# Altium project diban v0.0.PrjPCB
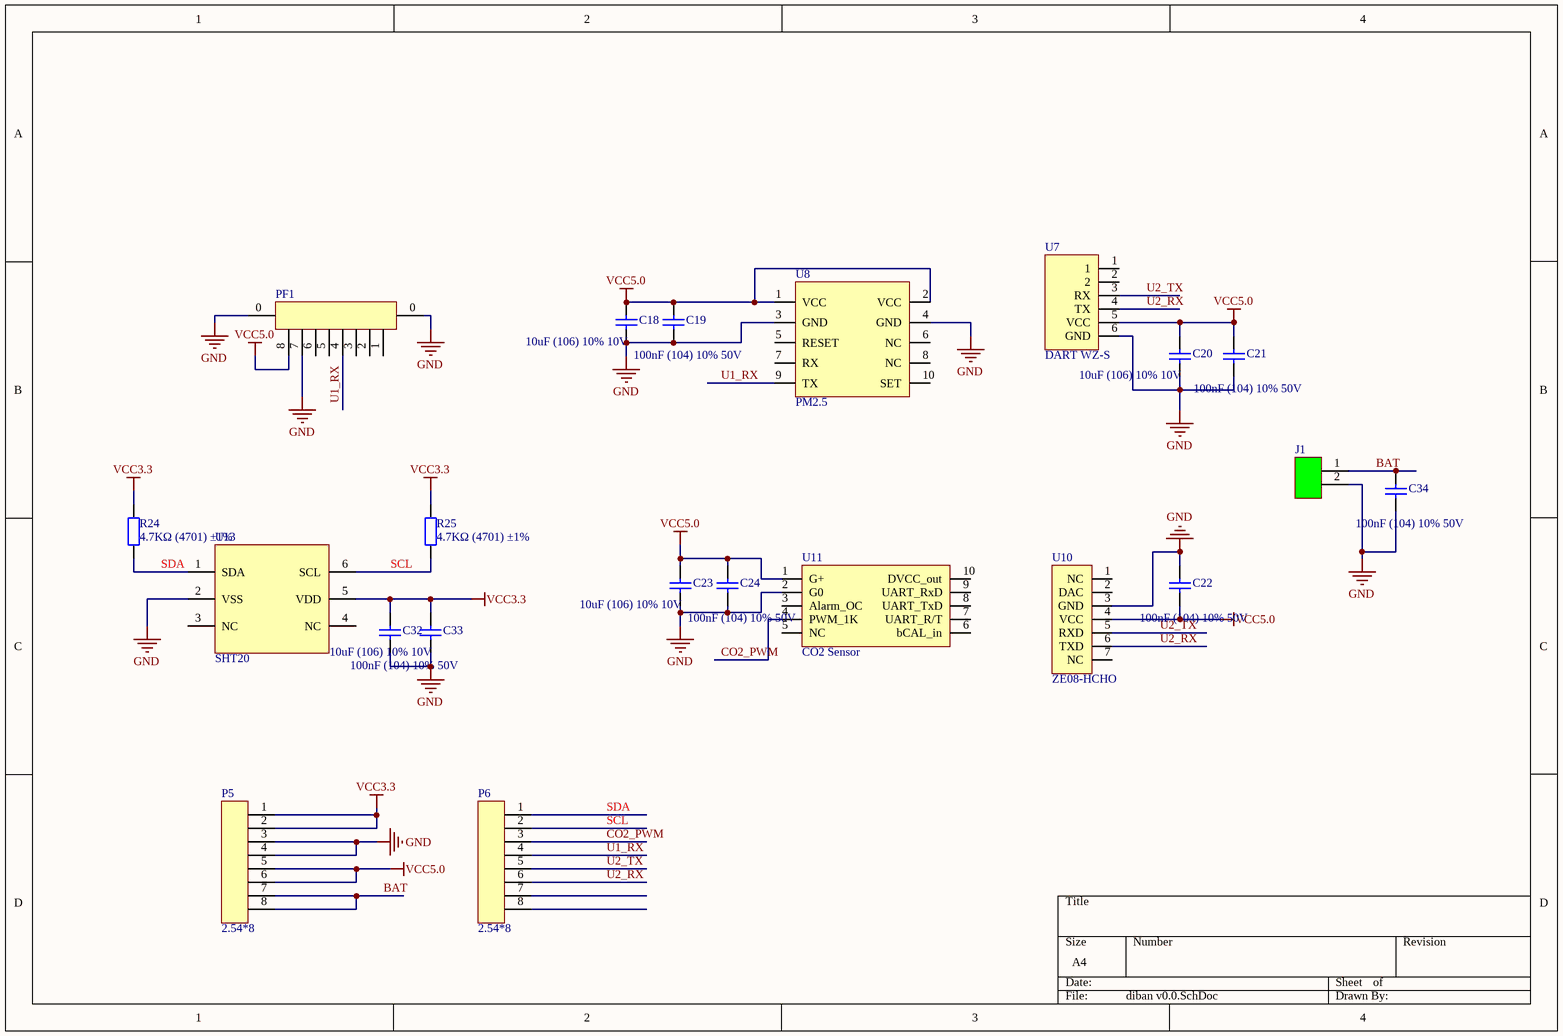
[diagram p0: diban v0.0.SchDoc]
1 sheet, 21 parts. Net scope: global (net labels, ports and power ports of the same name join across sheets).
Board file: diban v0.0.PcbDoc

## Sheet diban v0.0.SchDoc
size A4

### Parts
C18  10uF (106) 10% 10V  [0603_C]
C19  100nF (104) 10% 50V  [0603_C]
C20  10uF (106) 10% 10V  [0603_C]
C21  100nF (104) 10% 50V  [0603_C]
C22  100nF (104) 10% 50V  [0603_C]
C23  10uF (106) 10% 10V  [0603_C]
C24  100nF (104) 10% 50V  [0603_C]
C32  100nF (104) 10% 50V  [0603_C]
C33  10uF (106) 10% 10V  [0603_C]
C34  100nF (104) 10% 50V  [0603_C]
J1  3.5mm-2p  [3.5mm-2p]  (value not drawn)
P5  2.54*8  [2.54*8]
P6  2.54*8  [2.54*8]
PF1  PCF-8  [PCF-8]  (value not drawn)
R24  4.7KΩ (4701) ±1%  [0603_R]
R25  4.7KΩ (4701) ±1%  [0603_R]
U7  DART WZ-S  [DART WZ-S]
U8  PM2.5  [PM2.5]
U10  ZE08-HCHO  [ZE08-HCHO]
U11  CO2 Sensor  [CO2 Sensor]
U13  SHT20  [SHT20]

### Nets
GND: C18.1 C19.1 C20.1 C21.1 C22.2 C23.1 C24.1 C32.1 C33.1 C34.1 J1.2 P5.3 P5.4 PF1.0 PF1.7 U7.6(GND) U8.3(GND) U8.4(GND) U10.3(GND) U11.2(G0) U13.2(VSS)
VCC3.3: C32.2 C33.2 P5.1 P5.2 R24.2 R25.2 U13.5(VDD)
VCC5.0: C18.2 C19.2 C20.2 C21.2 C22.1 C23.2 C24.2 P5.5 P5.6 PF1.8 U7.5(VCC) U8.1(VCC) U8.2(VCC) U10.4(VCC) U11.1(G+)
BAT: C34.2 J1.1 P5.7 P5.8
CO2_PWM: P6.3 U11.4(PWM_1K)
SCL: P6.2 R25.1 U13.6(SCL)
SDA: P6.1 R24.1 U13.1(SDA)
U1_RX: P6.4 PF1.4 U8.9(TX)
U2_RX: P6.6 U7.4(TX) U10.6(TXD)
U2_TX: P6.5 U7.3(RX) U10.5(RXD)

Not connected (* = marked no-connect by the designer): P6 7 8; PF1 1 2 3 5 6; U7 1 2; U8 5(RESET) 6(NC) 7(RX) 8(NC) 10(SET); U10 1(NC) 2(DAC) 7(NC); U11 3(Alarm_OC) 5(NC) 6(bCAL_in) 7(UART_R/T) 8(UART_TxD) 9(UART_RxD) 10(DVCC_out); U13 3(NC) 4(NC)

### Library data of the parts
C18 C20 C23 C33 = 0603 10uF (106) 10% 10V: 贴片电容; ComponentLink1Description: 供应商链接; ComponentLink1URL: http://www.szlcsc.com/product/details_20411.html; Package: 0603; Supplier: LC; SuppliersPartNumber: C19702
C19 C21 C22 C24 C32 C34 = 0603 100nF (104) 10% 50V: 贴片电容; ComponentLink1Description: 供应商链接; ComponentLink1URL: http://www.szlcsc.com/product/details_15331.html; Package: 0603; Supplier: LC; SuppliersPartNumber: C14663
R24 R25 = 0603 4.7KΩ (4701) 1%: 贴片电阻; ComponentLink1Description: 供应商链接; ComponentLink1URL: http://www.szlcsc.com/product/details_23889.html; Package: 0603; Supplier: LC; SuppliersPartNumber: C23162